# EAGLE design CAN-Interface (EAGLE 9.5.2)
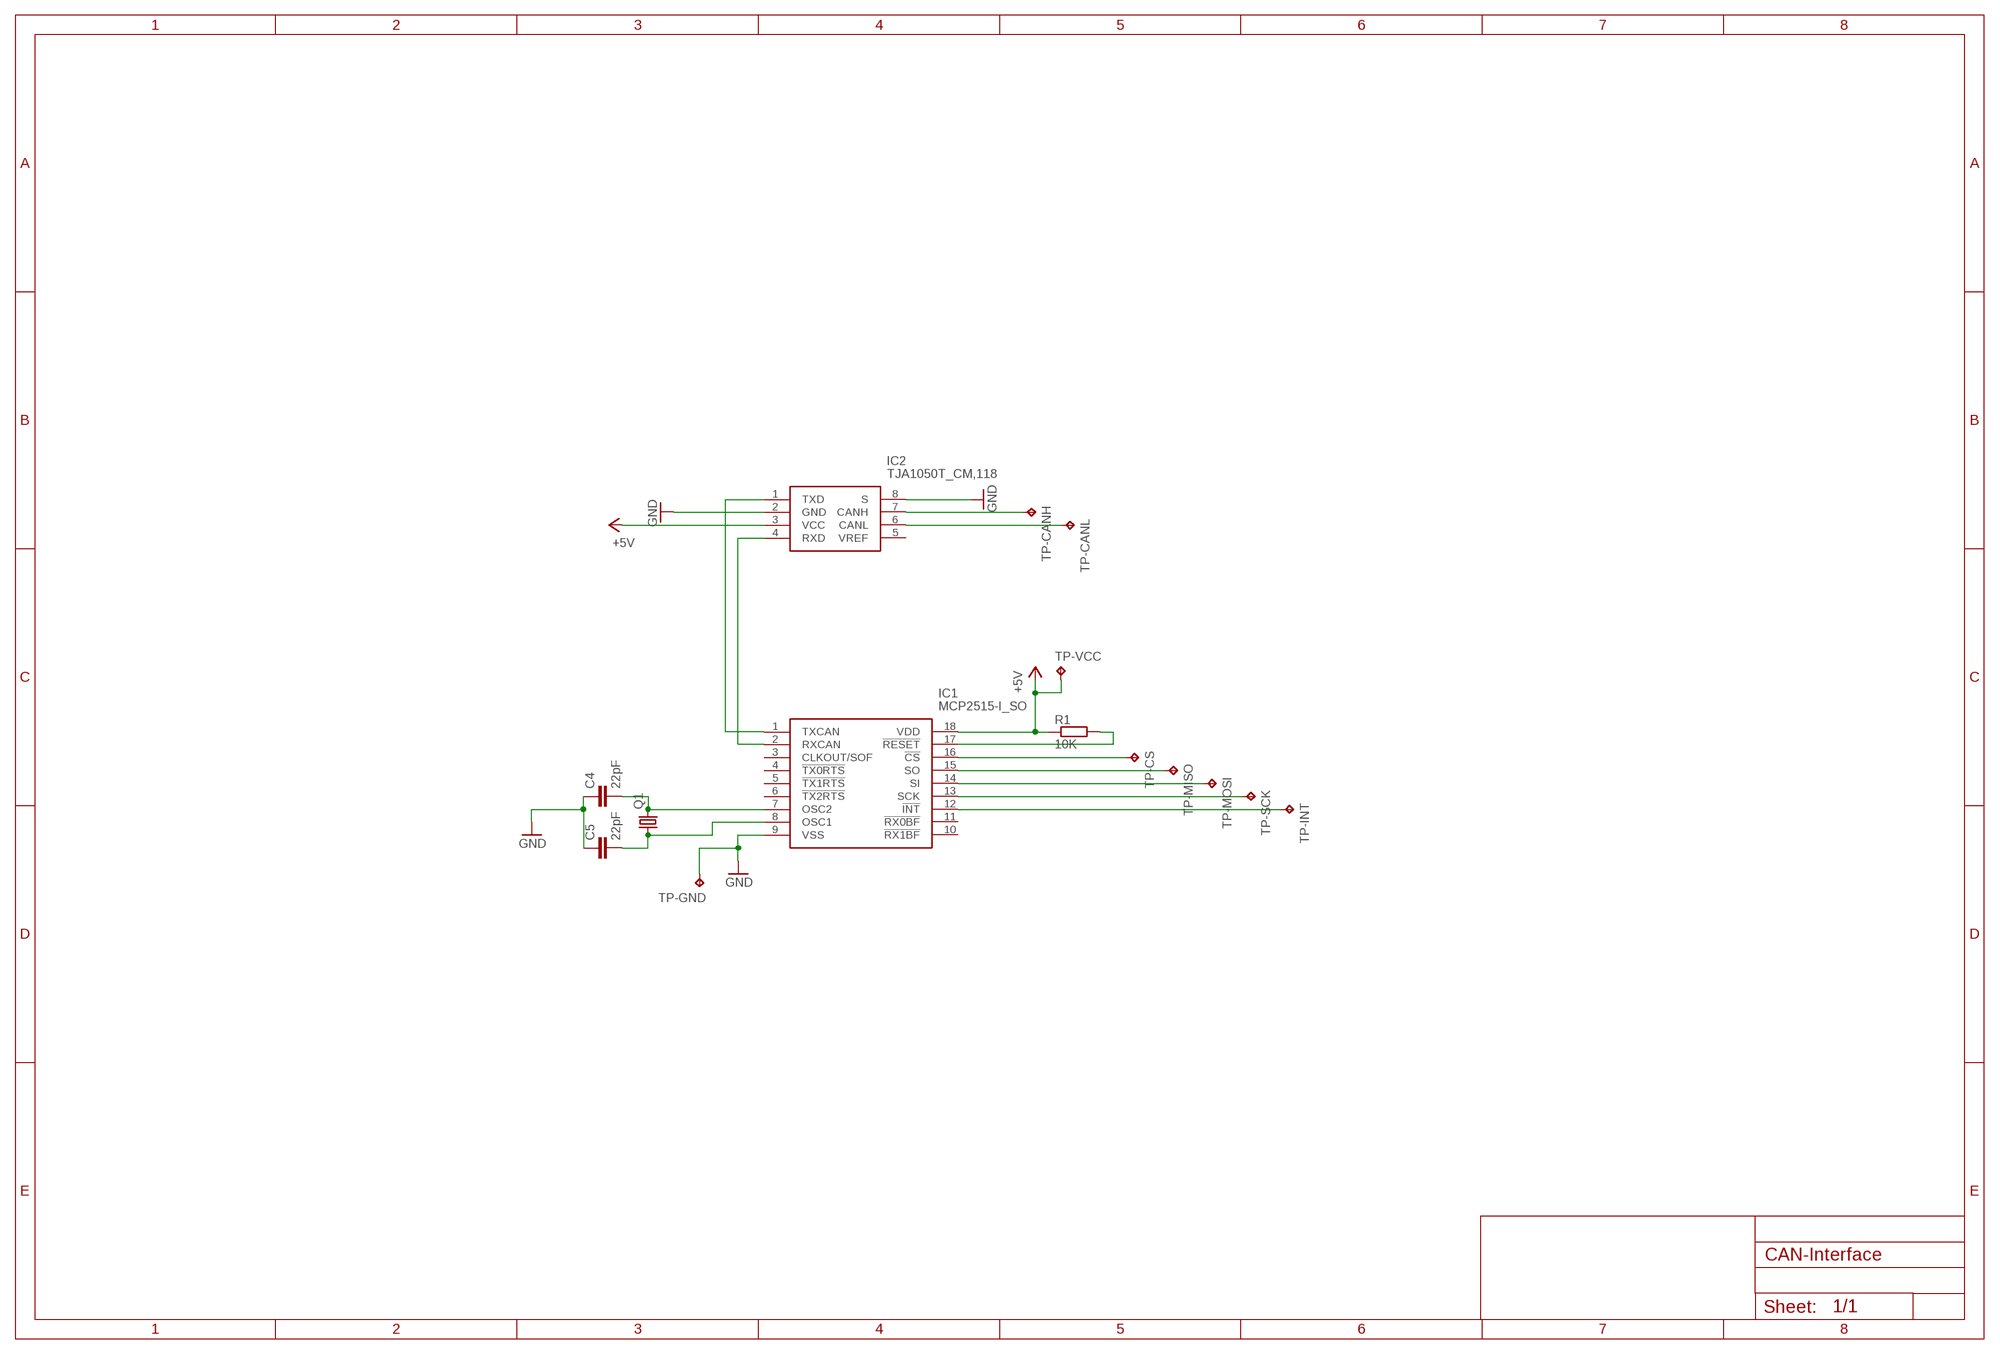
[diagram p0: schematic, sheet 1]

## Parts
C4  22pF  C-EU025-050X050  [C025-050X050]
C5  22pF  C-EU025-050X050  [C025-050X050]
IC1  MCP2515-I_SO  [SOIC127P1030X265-18N]
IC2  TJA1050T_CM,118  [SOIC127P600X175-8N]
Q1  CRYSTALHC49S  [HC49/S]
R1  10K  R-EU_0204/7  [0204/7]
TP-CANH  TPB1,27  [B1,27]
TP-CANL  TPB1,27  [B1,27]
TP-CS  TPB1,27  [B1,27]
TP-GND  TPB1,27  [B1,27]
TP-INT  TPB1,27  [B1,27]
TP-MISO  TPB1,27  [B1,27]
TP-MOSI  TPB1,27  [B1,27]
TP-SCK  TPB1,27  [B1,27]
TP-VCC  TPB1,27  [B1,27]

## Nets
+5V: IC1.18(VDD) IC2.3(VCC) R1.1 TP-VCC.TP
GND: C4.1 C5.1 IC1.9(VSS) IC2.2(GND) IC2.8(S) TP-GND.TP
N$1: C4.2 IC1.7(OSC2) Q1.2
N$2: C5.2 IC1.8(OSC1) Q1.1
N$3: IC2.7(CANH) TP-CANH.TP
N$4: IC2.6(CANL) TP-CANL.TP
N$5: IC1.16(!CS) TP-CS.TP
N$6: IC1.15(SO) TP-MISO.TP
N$7: IC1.14(SI) TP-MOSI.TP
N$8: IC1.17(!RESET) R1.2
N$9: IC1.1(TXCAN) IC2.1(TXD)
N$10: IC1.2(RXCAN) IC2.4(RXD)
N$11: IC1.13(SCK) TP-SCK.TP
N$12: IC1.12(!INT) TP-INT.TP
Unconnected: IC1.3(CLKOUT/SOF) IC1.4(!TX0RTS) IC1.5(!TX1RTS) IC1.6(!TX2RTS) IC1.10(!RX1BF) IC1.11(!RX0BF) IC2.5(VREF)

## Library data of the parts
C4 C5 = rcl:C-EU: CAPACITOR, European symbol; SPICEPREFIX: C
IC1 = Custom:MCP2515-I_SO: CAN Controller SPI data filtering SO18 Source: Datasheet <https://componentsearchengine.com/Datasheets/1/MCP2515-I_SO.pdf>; DESCRIPTION: CAN Controller SPI data filtering SO18; HEIGHT: 2.65mm; MANUFACTURER_NAME: Microchip; MANUFACTURER_PART_NUMBER: MCP2515-I/SO; MOUSER_PART_NUMBER: 579-MCP2515-I/SO; MOUSER_PRICE-STOCK: https://www.mouser.com/Search/Refine.aspx?Keyword=579-MCP2515-I%2FSO
IC2 = Custom:TJA1050T_CM,118: NXP - TJA1050T/CM,118 - CAN TRANSCEIVER, 1TX/RX, SOIC-8 Source: Datasheet <https://componentsearchengine.com/Datasheets/1/TJA1050T_CM,118.pdf>; DESCRIPTION: NXP - TJA1050T/CM,118 - CAN TRANSCEIVER, 1TX/RX, SOIC-8; HEIGHT: 1.75mm; MANUFACTURER_NAME: Nexperia; MANUFACTURER_PART_NUMBER: TJA1050T/CM,118; MOUSER_PART_NUMBER: 771-TJA1050T/CM118; MOUSER_PRICE-STOCK: https://www.mouser.com/Search/Refine.aspx?Keyword=771-TJA1050T%2FCM118
Q1 = crystal:CRYSTAL: CRYSTAL; OC_FARNELL: 1667008; OC_NEWARK: unknown
R1 = rcl:R-EU_: RESISTOR, European symbol; SPICEPREFIX: R
TP-CANH TP-CANL TP-CS TP-GND TP-INT TP-MISO TP-MOSI TP-SCK TP-VCC = testpad:TP: Test pad

## Board
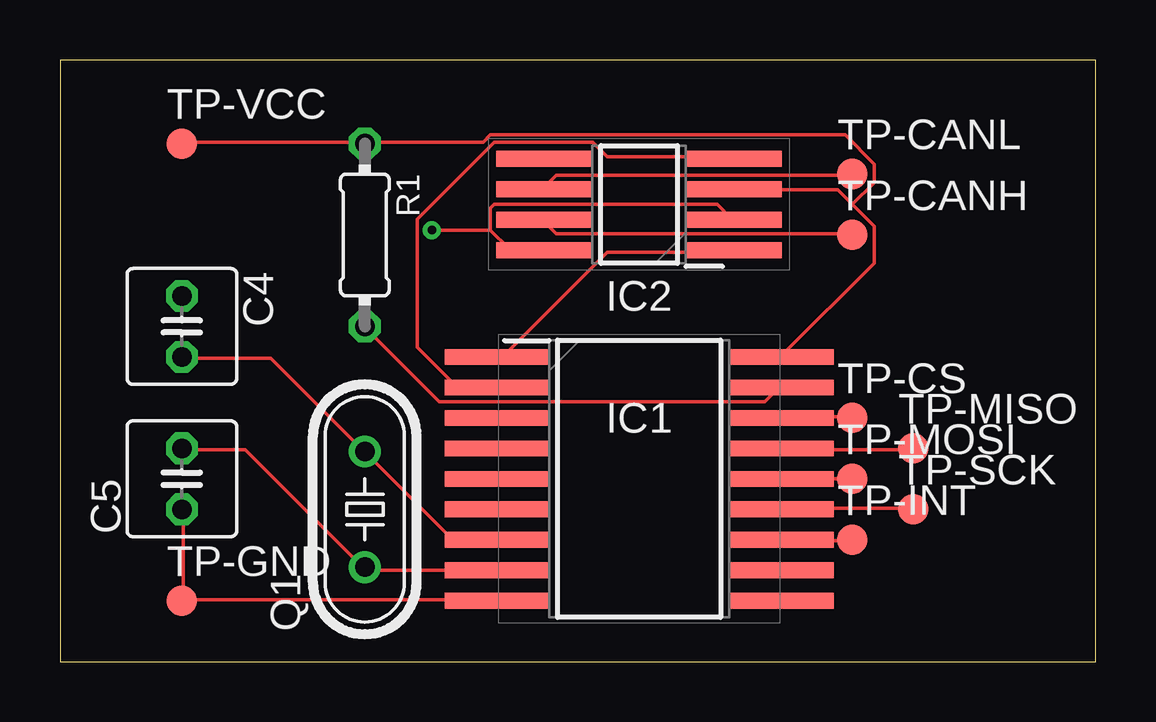
[diagram p1: board, top side]
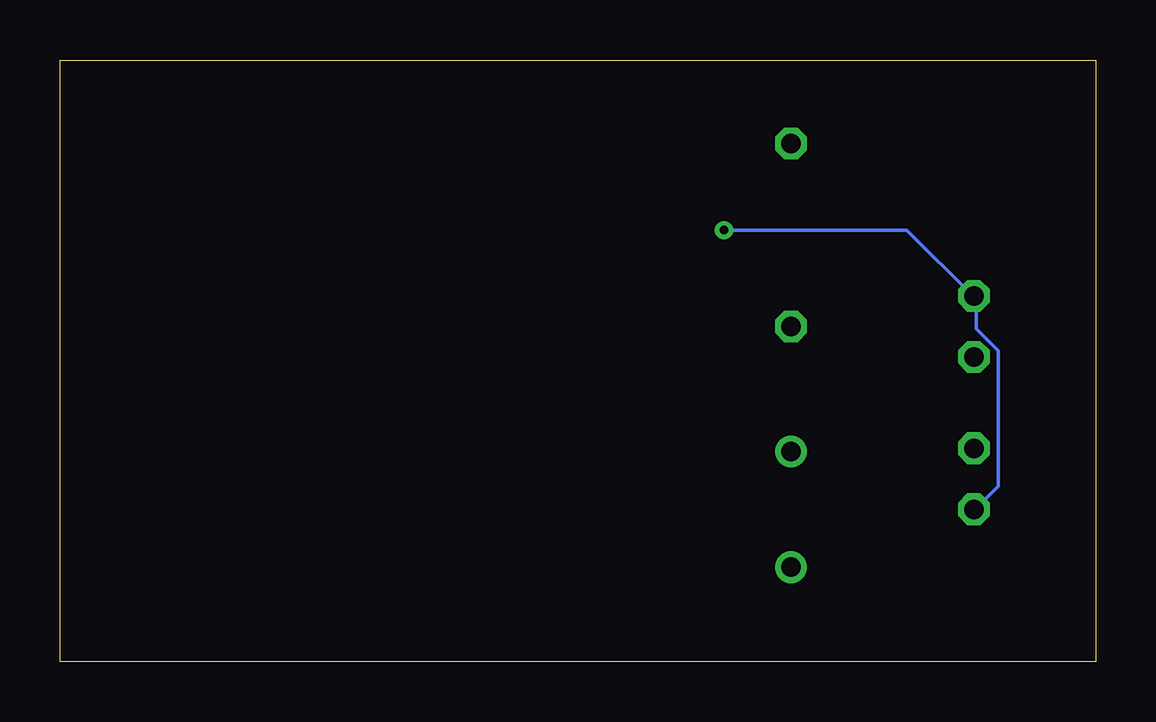
[diagram p2: board, bottom side, seen from below]

Size 43.16 x 25.07 mm. Coordinates in mm from the lower left corner, seen from the top.
Outline: 0,0 43.16,0 43.16,25.07 0,25.07 0,0
Copper layers (1*16): Top 0.035mm / dielectric 1.5mm / Bottom 0.035mm
Design rules "default *": minimum track width 6mil, minimum drill 0.35mm, track to track 6mil, track to pad 6mil, pad to pad 6mil, via to via 6mil, smd to smd 6mil, copper to edge 40mil, drill to drill 6mil, minimum pad ring 10mil, minimum via ring 8mil, stop-mask expansion 4mil, vias tented up to drill 0mil, thermal gap 10mil

### Footprints (pad centres in the part's own frame; a part is rotated, then mirrored left to right if it is on the bottom)
C025-050X050 = drill 0.813 octagon: 1 -1.27,0; 2 1.27,0
SOIC127P1030X265-18N = smd 4.318 x 0.65: 1 -5.945,5.08; 2 -5.945,3.81; 3 -5.945,2.54; 4 -5.945,1.27; 5 -5.945,0; 6 -5.945,-1.27; 7 -5.945,-2.54; 8 -5.945,-3.81; 9 -5.945,-5.08; 10 5.945,-5.08; 11 5.945,-3.81; 12 5.945,-2.54; 13 5.945,-1.27; 14 5.945,0; 15 5.945,1.27; 16 5.945,2.54; 17 5.945,3.81; 18 5.945,5.08
SOIC127P600X175-8N = smd 3.937 x 0.65: 1 -3.981,1.905; 2 -3.981,0.635; 3 -3.981,-0.635; 4 -3.981,-1.905; 5 3.981,-1.905; 6 3.981,-0.635; 7 3.981,0.635; 8 3.981,1.905
HC49/S = drill 0.813: 1 -2.413,0; 2 2.413,0
0204/7 = drill 0.813 octagon: 1 -3.81,0; 2 3.81,0
B1,27 = smd 1.27 x 1.27: TP 0,0

### Placement (x,y rotation side)
C4  5.08,13.97 270 top
C5  5.08,7.62 90 top
IC1  24.13,7.62 0 top
IC2  24.13,19.05 180 top
Q1  12.7,6.35 90 top
R1  12.7,17.78 270 top
TP-CANH  33.02,17.78 0 top
TP-CANL  33.02,20.32 0 top
TP-CS  33.02,10.16 0 top
TP-GND  5.08,2.54 0 top
TP-INT  33.02,5.08 0 top
TP-MISO  35.56,8.89 0 top
TP-MOSI  33.02,7.62 0 top
TP-SCK  35.56,6.35 0 top
TP-VCC  5.08,21.59 0 top

### Tracks (layer width: path | path; a pad name or v marks a point on that pad's centre or on a via)
+5V
  Top 0.152: TP-VCC.TP 5.13,21.64 12.6,21.64 R1.1 12.75,21.64 17.63,21.64 17.93,21.95 32.72,21.95 33.93,20.73 33.93,19.96 33.02,19.05 | 33.02,19.05 33.93,18.14 33.93,16.61 30.12,12.8 IC1.18 | 33.02,19.05 32.41,19.66 28.14,19.66 IC2.3
GND  (via drill 0.35)
  Top 0.152: 17.93,17.98 18.69,17.22 20.07,17.22 IC2.8 | 17.93,17.98 17.93,18.9 18.08,19.05 27.38,19.05 27.99,18.44 IC2.2 | 5.13,2.59 5.13,6.25 C5.1 | 5.13,2.59 18.08,2.59 IC1.9 | 5.13,2.59 TP-GND.TP | v15.49,17.98 17.93,17.98
  Bottom 0.152: C5.1 4.98,6.4 4.06,7.32 4.06,12.95 4.98,13.87 4.98,15.24 C4.1 5.13,15.24 7.87,17.98 v15.49,17.98
N$1
  Top 0.152: C4.2 5.13,12.65 8.79,12.65 12.6,8.84 Q1.2 12.75,8.69 16.26,5.18 18.08,5.18 IC1.7
N$2
  Top 0.152: C5.2 5.13,8.84 7.72,8.84 12.6,3.96 Q1.1 12.75,3.81 IC1.8
N$3
  Top 0.152: TP-CANH.TP 33.02,17.83 20.68,17.83 20.22,18.29 IC2.7
N$4
  Top 0.152: TP-CANL.TP 33.02,20.27 20.68,20.27 20.22,19.81 IC2.6
N$5
  Top 0.152: TP-CS.TP 33.02,10.21 30.12,10.21 IC1.16
N$6
  Top 0.152: TP-MISO.TP 35.46,8.84 30.12,8.84 IC1.15
N$7
  Top 0.152: IC1.14 TP-MOSI.TP
N$8
  Top 0.152: R1.2 12.75,13.87 15.8,10.82 29.36,10.82 29.97,11.43 IC1.17
N$9
  Top 0.152: IC2.1 27.99,17.07 22.81,17.07 18.54,12.8 18.24,12.8 IC1.1
N$10
  Top 0.152: IC1.2 16.56,11.43 14.88,13.11 14.88,18.44 18.08,21.64 22.2,21.64 22.81,21.03 27.99,21.03 IC2.4
N$11
  Top 0.152: TP-SCK.TP 35.46,6.4 30.12,6.4 IC1.13
N$12
  Top 0.152: TP-INT.TP 33.02,5.03 30.12,5.03 IC1.12